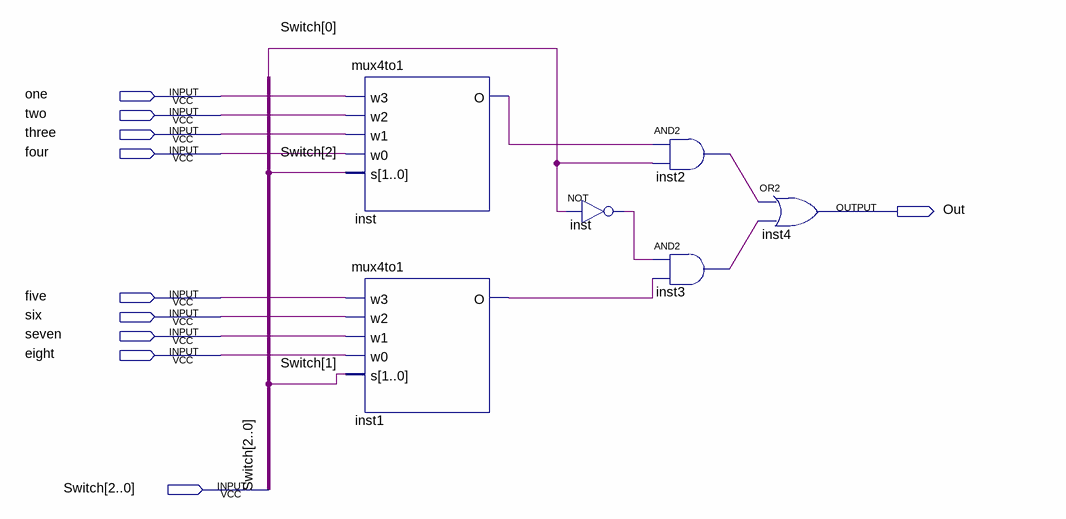
[diagram p0: schematic sheet]
// Quartus schematic eightto14bit.bdf as structural Verilog: 6 symbols, 10 pins
module eightto14bit (
  input  one,
  input  two,
  input  three,
  input  four,
  input  five,
  input  six,
  input  seven,
  input  eight,
  input  [2:0] Switch,
  output Out
);

  wire inst1_o, inst2_out, inst3_out, inst_o, inst_out;

  mux4to1 inst (.w3(one), .w2(two), .w1(three), .w0(four), .s({2{Switch[2]}}), .O(inst_o));
  mux4to1 inst1 (.w3(five), .w2(six), .w1(seven), .w0(eight), .s({2{Switch[1]}}), .O(inst1_o));
  not inst_dup2 (inst_out, Switch[0]);
  and inst2 (inst2_out, inst_o, Switch[0]);
  and inst3 (inst3_out, inst_out, inst1_o);
  or inst4 (Out, inst2_out, inst3_out);
endmodule
